# EAGLE design ESP12Proto-V1.0 (EAGLE 7.4.0)
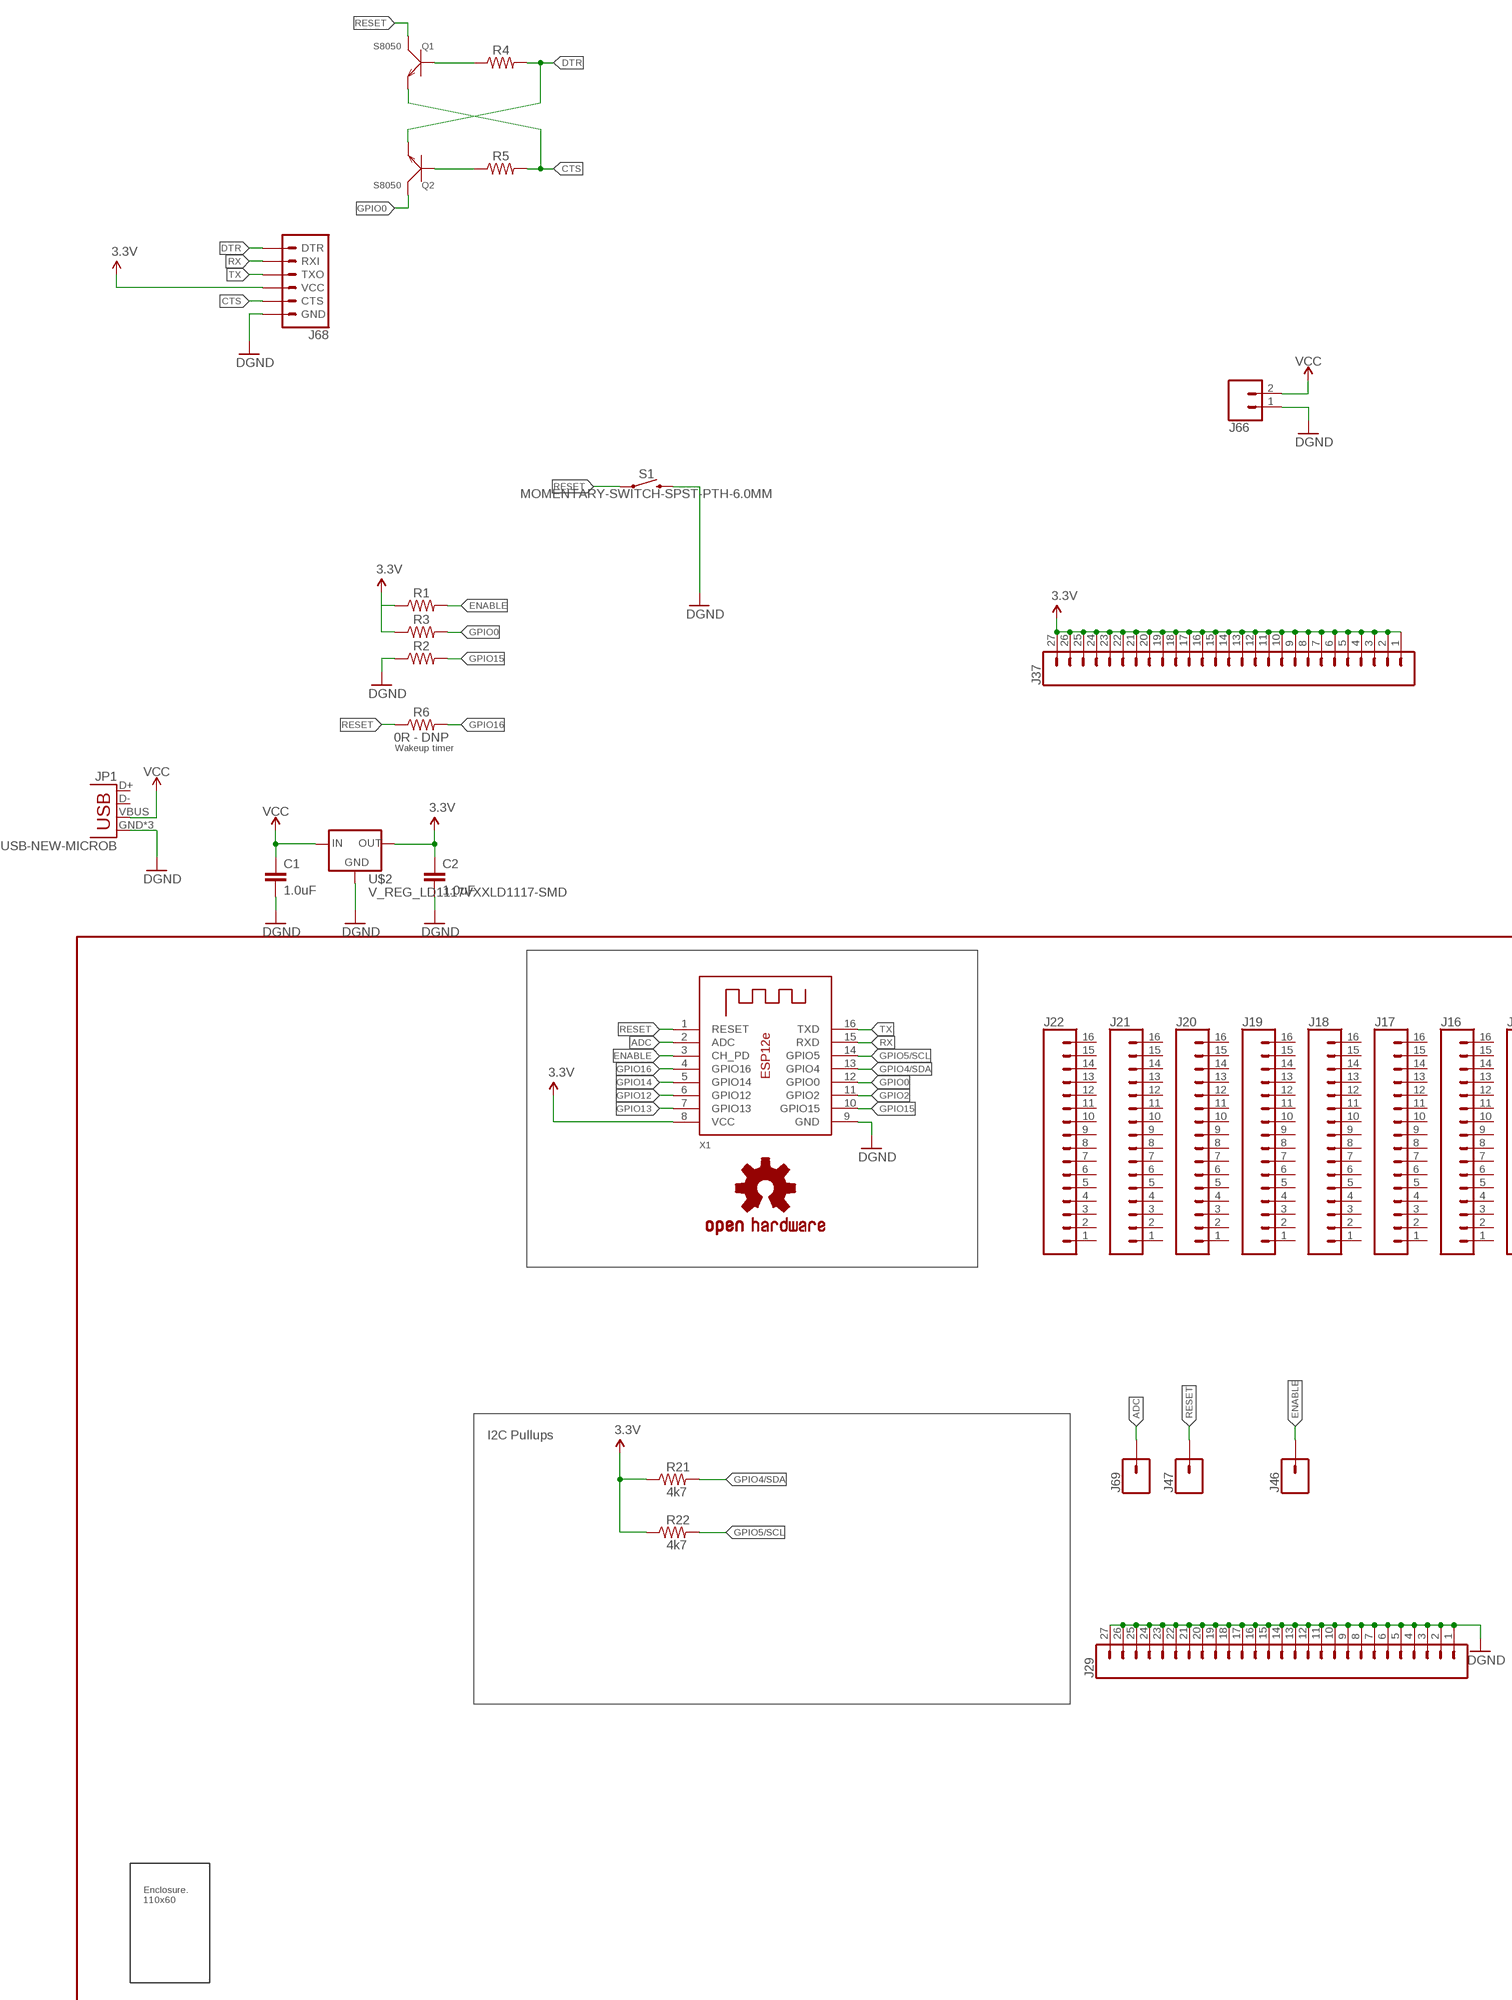
[diagram p0: schematic, sheet 1, part 1 of 2]
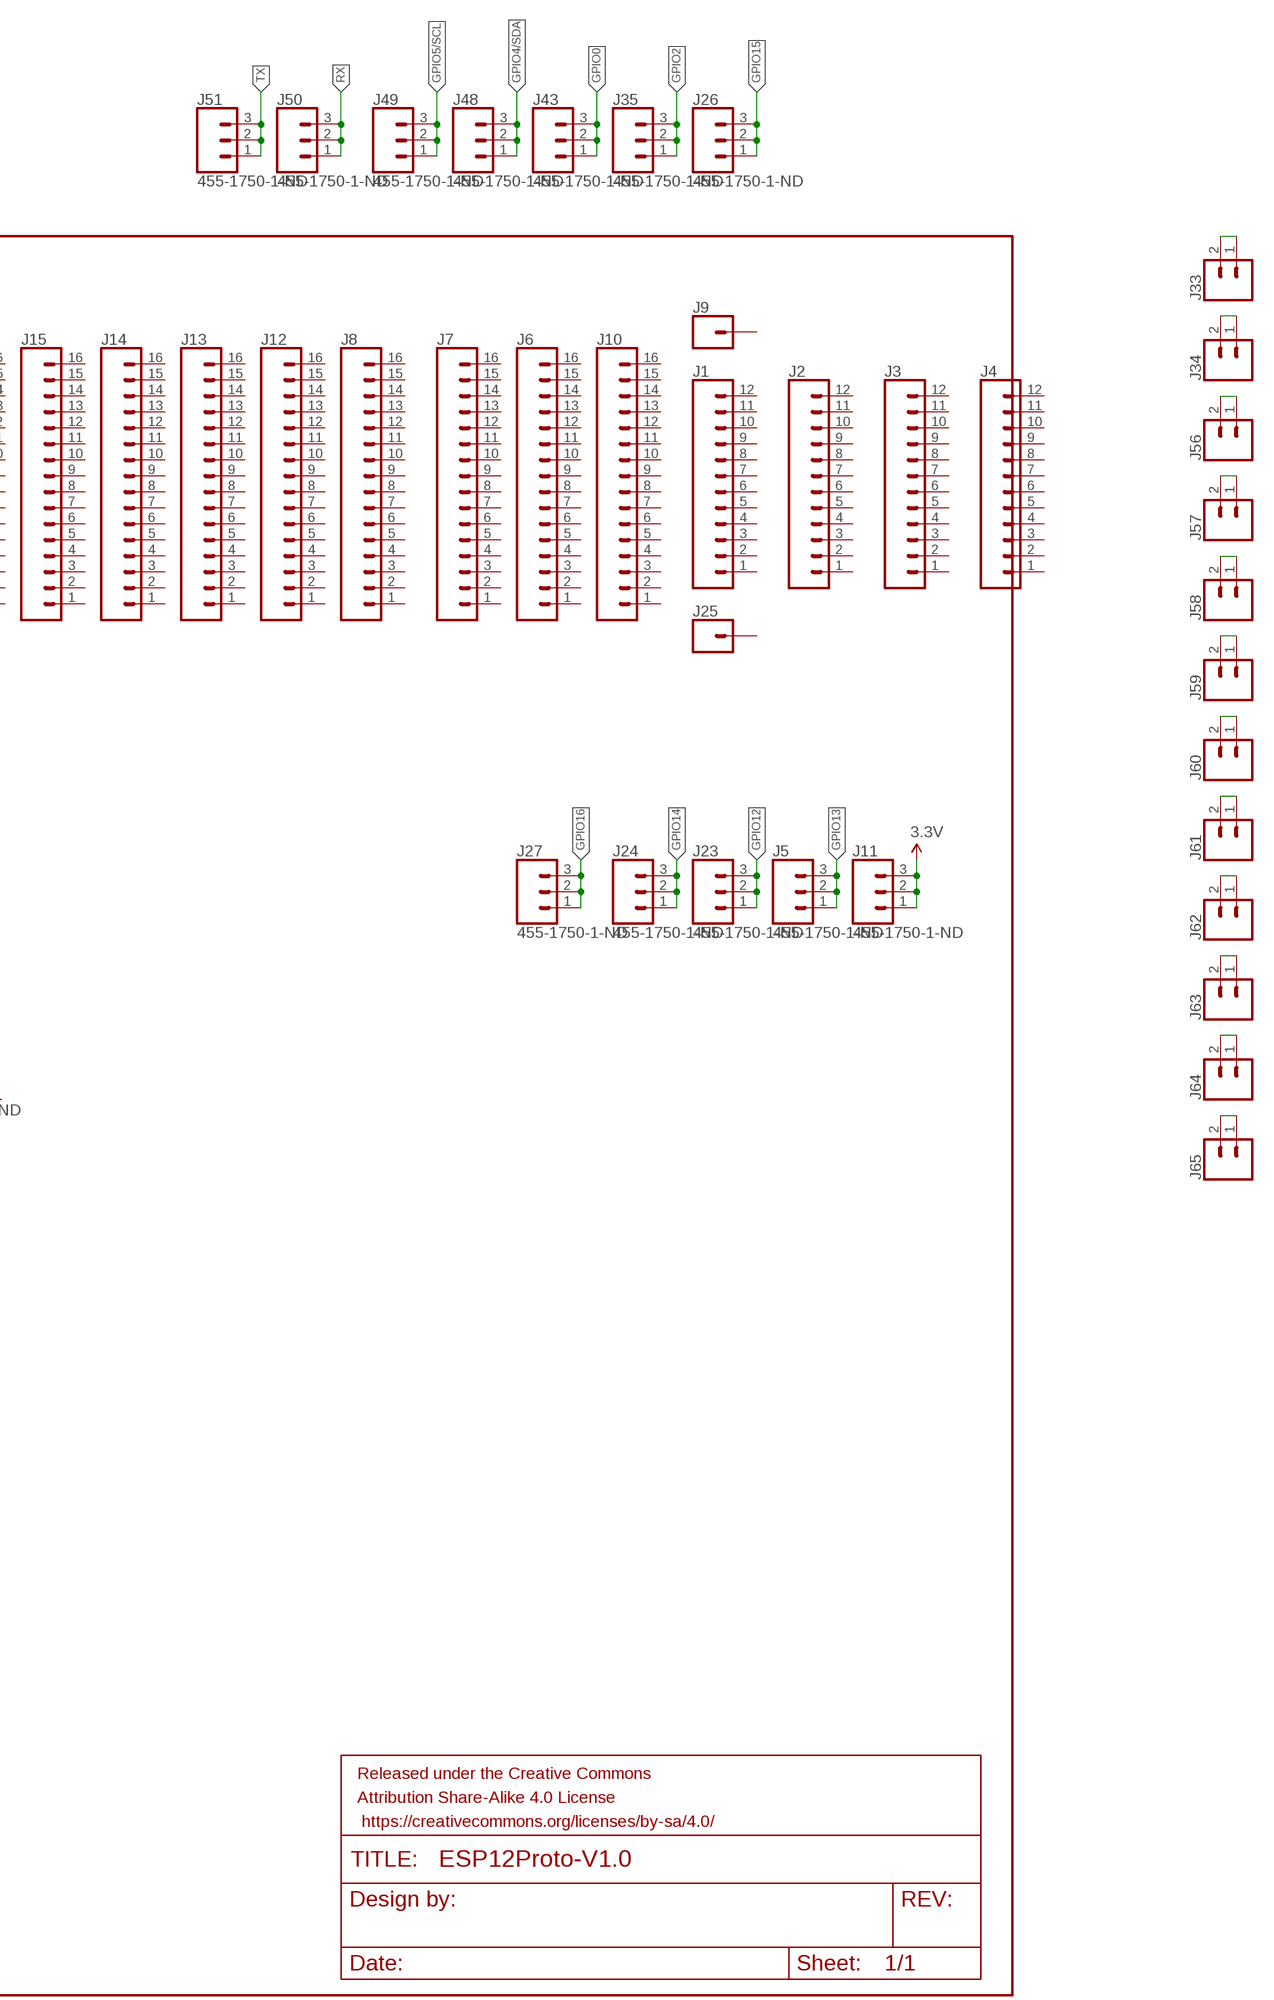
[diagram p1: schematic, sheet 1, part 2 of 2]

## Parts
C1  1.0uF  1.0UF-0805-25V-10%  [0805]
C2  1.0uF  1.0UF-0805-25V-10%  [0805]
FRAME2  FRAME-LEDGER  [CREATIVE_COMMONS]
J1  CONN_12NO_SILK  [1X12_NO_SILK]
J2  CONN_12NO_SILK  [1X12_NO_SILK]
J3  CONN_12NO_SILK  [1X12_NO_SILK]
J4  CONN_12NO_SILK  [1X12_NO_SILK]
J5  455-1750-1-ND  CONN_03  [1X03]
J6  CONN_161X16_NO_SILK  [1X16_NO_SILK]
J7  CONN_161X16_NO_SILK  [1X16_NO_SILK]
J8  CONN_161X16_NO_SILK  [1X16_NO_SILK]
J9  CONN_01PTH_NO_SILK_YES_STOP  [1X01_NO_SILK]
J10  CONN_161X16_NO_SILK  [1X16_NO_SILK]
J11  455-1750-1-ND  CONN_03  [1X03]
J12  CONN_161X16_NO_SILK  [1X16_NO_SILK]
J13  CONN_161X16_NO_SILK  [1X16_NO_SILK]
J14  CONN_161X16_NO_SILK  [1X16_NO_SILK]
J15  CONN_161X16_NO_SILK  [1X16_NO_SILK]
J16  CONN_161X16_NO_SILK  [1X16_NO_SILK]
J17  CONN_161X16_NO_SILK  [1X16_NO_SILK]
J18  CONN_161X16_NO_SILK  [1X16_NO_SILK]
J19  CONN_161X16_NO_SILK  [1X16_NO_SILK]
J20  CONN_161X16_NO_SILK  [1X16_NO_SILK]
J21  CONN_161X16_NO_SILK  [1X16_NO_SILK]
J22  CONN_161X16_NO_SILK  [1X16_NO_SILK]
J23  455-1750-1-ND  CONN_03  [1X03]
J24  455-1750-1-ND  CONN_03  [1X03]
J25  CONN_01PTH_NO_SILK_YES_STOP  [1X01_NO_SILK]
J26  455-1750-1-ND  CONN_03  [1X03]
J27  455-1750-1-ND  CONN_03  [1X03]
J29  CONN_27  [1X27]
J33  CONN_02  [1X02]
J34  CONN_02  [1X02]
J35  455-1750-1-ND  CONN_03  [1X03]
J37  CONN_27  [1X27]
J43  455-1750-1-ND  CONN_03  [1X03]
J46  CONN_01PTH_NO_SILK_YES_STOP  [1X01_NO_SILK]
J47  CONN_01PTH_NO_SILK_YES_STOP  [1X01_NO_SILK]
J48  455-1750-1-ND  CONN_03  [1X03]
J49  455-1750-1-ND  CONN_03  [1X03]
J50  455-1750-1-ND  CONN_03  [1X03]
J51  455-1750-1-ND  CONN_03  [1X03]
J56  CONN_02  [1X02]
J57  CONN_02  [1X02]
J58  CONN_02  [1X02]
J59  CONN_02  [1X02]
J60  CONN_02  [1X02]
J61  CONN_02  [1X02]
J62  CONN_02  [1X02]
J63  CONN_02  [1X02]
J64  CONN_02  [1X02]
J65  CONN_02  [1X02]
J66  CONN_02-JST-2MM-SMT  [JST-2-SMD]
J68  6_PIN_SERIAL_TARGETSILK  [6_PIN_SERIAL_TARGET_SIDE_W_SILK]
J69  CONN_01PTH_NO_SILK_YES_STOP  [1X01_NO_SILK]
JP1  USB-NEW-MICROB  [USB-MICROB]
LOGO1  OSHW-LOGOM  [OSHW-LOGO-M]
Q1  S8050  SMD-TRANSISTORS-NPN-25V-500MW-S8050(SOT-23)  [SOT-23]
Q2  S8050  SMD-TRANSISTORS-NPN-25V-500MW-S8050(SOT-23)  [SOT-23]
R1  RESISTOR0805  [0805]
R2  RESISTOR0805  [0805]
R3  RESISTOR0805  [0805]
R4  RESISTOR0805  [0805]
R5  RESISTOR0805  [0805]
R6  0R - DNP  RESISTOR0805  [0805]
R21  4k7  RESISTOR0805  [0805]
R22  4k7  RESISTOR0805  [0805]
S1  MOMENTARY-SWITCH-SPST-PTH-6.0MM  [TACTILE_SWITCH_PTH_6.0MM]
U$1  CAMDENBOSS-ENCLOSURE-110X60BOTH-EXTENDED-WIDE  [CAMDENBOSS_ENCLOSURE_110X60_WIDE_EXTENDED]
U$2  V_REG_LD1117VXXLD1117-SMD  [SOT223]
X1  ESP-12E  [ESP-12E]

## Nets
3.3V: C2.1 J11.1 J11.2 J11.3 J37.1 J37.2 J37.3 J37.4 J37.5 J37.6 J37.7 J37.8 J37.9 J37.10 J37.11 J37.12 J37.13 J37.14 J37.15 J37.16 J37.17 J37.18 J37.19 J37.20 J37.21 J37.22 J37.23 J37.24 J37.25 J37.26 J37.27 J68.P$4(VCC) R1.1 R3.1 R21.1 R22.1 U$2.2(OUT) X1.8(VCC)
ADC: J69.1 X1.2(ADC)
CTS: J68.P$5(CTS) Q1.2(E) R5.2
DTR: J68.P$1(DTR) Q2.2(E) R4.2
ENABLE: J46.1 R1.2 X1.3(CH_PD)
GND: C1.2 C2.2 J29.1 J29.2 J29.3 J29.4 J29.5 J29.6 J29.7 J29.8 J29.9 J29.10 J29.11 J29.12 J29.13 J29.14 J29.15 J29.16 J29.17 J29.18 J29.19 J29.20 J29.21 J29.22 J29.23 J29.24 J29.25 J29.26 J29.27 J66.1 J68.P$6(GND) JP1.GND JP1.MT1(GND) JP1.MT2(GND) R2.1 S1.3 U$2.1(GND) X1.9(GND) ; supply symbol labelled DGND
GPIO0: J43.1 J43.2 J43.3 Q2.3(C) R3.2 X1.12(GPIO0)
GPIO2: J35.1 J35.2 J35.3 X1.11(GPIO2)
GPIO4/SDA: J48.1 J48.2 J48.3 R21.2 X1.13(GPIO4)
GPIO5/SCL: J49.1 J49.2 J49.3 R22.2 X1.14(GPIO5)
GPIO12: J23.1 J23.2 J23.3 X1.6(GPIO12)
GPIO13: J5.1 J5.2 J5.3 X1.7(GPIO13)
GPIO14: J24.1 J24.2 J24.3 X1.5(GPIO14)
GPIO15: J26.1 J26.2 J26.3 R2.2 X1.10(GPIO15)
GPIO16: J27.1 J27.2 J27.3 R6.2 X1.4(GPIO16)
N$21: J65.1 J65.2
N$22: J64.1 J64.2
N$23: J63.1 J63.2
N$24: J62.1 J62.2
N$25: J61.1 J61.2
N$26: J60.1 J60.2
N$27: J59.1 J59.2
N$28: J58.1 J58.2
N$29: J57.1 J57.2
N$30: J56.1 J56.2
N$31: J34.1 J34.2
N$33: J33.1 J33.2
N$35: Q2.1(B) R5.1
N$36: Q1.1(B) R4.1
RESET: J47.1 Q1.3(C) R6.1 S1.1 X1.1(RESET)
RX: J50.1 J50.2 J50.3 J68.P$3(RXI) X1.15(RXD)
TX: J51.1 J51.2 J51.3 J68.P$2(TXO) X1.16(TXD)
VCC: C1.1 J66.2 JP1.VBUS U$2.3(IN)
Unconnected: J1.1 J1.2 J1.3 J1.4 J1.5 J1.6 J1.7 J1.8 J1.9 J1.10 J1.11 J1.12 J2.1 J2.2 J2.3 J2.4 J2.5 J2.6 J2.7 J2.8 J2.9 J2.10 J2.11 J2.12 J3.1 J3.2 J3.3 J3.4 J3.5 J3.6 J3.7 J3.8 J3.9 J3.10 J3.11 J3.12 J4.1 J4.2 J4.3 J4.4 J4.5 J4.6 J4.7 J4.8 J4.9 J4.10 J4.11 J4.12 J6.1 J6.2 J6.3 J6.4 J6.5 J6.6 J6.7 J6.8 J6.9 J6.10 J6.11 J6.12 J6.13 J6.14 J6.15 J6.16 J7.1 J7.2 J7.3 J7.4 J7.5 J7.6 J7.7 J7.8 J7.9 J7.10 J7.11 J7.12 J7.13 J7.14 J7.15 J7.16 J8.1 J8.2 J8.3 J8.4 J8.5 J8.6 J8.7 J8.8 J8.9 J8.10 J8.11 J8.12 J8.13 J8.14 J8.15 J8.16 J9.1 J10.1 J10.2 J10.3 J10.4 J10.5 J10.6 J10.7 J10.8 J10.9 J10.10 J10.11 J10.12 J10.13 J10.14 J10.15 J10.16 J12.1 J12.2 J12.3 J12.4 J12.5 J12.6 J12.7 J12.8 J12.9 J12.10 J12.11 J12.12 J12.13 J12.14 J12.15 J12.16 J13.1 J13.2 J13.3 J13.4 J13.5 J13.6 J13.7 J13.8 J13.9 J13.10 J13.11 J13.12 J13.13 J13.14 J13.15 J13.16 J14.1 J14.2 J14.3 J14.4 J14.5 J14.6 J14.7 J14.8 J14.9 J14.10 J14.11 J14.12 J14.13 J14.14 J14.15 J14.16 J15.1 J15.2 J15.3 J15.4 J15.5 J15.6 J15.7 J15.8 J15.9 J15.10 J15.11 J15.12 J15.13 J15.14 J15.15 J15.16 J16.1 J16.2 J16.3 J16.4 J16.5 J16.6 J16.7 J16.8 J16.9 J16.10 J16.11 J16.12 J16.13 J16.14 J16.15 J16.16 J17.1 J17.2 J17.3 J17.4 J17.5 J17.6 J17.7 J17.8 J17.9 J17.10 J17.11 J17.12 J17.13 J17.14 J17.15 J17.16 J18.1 J18.2 J18.3 J18.4 J18.5 J18.6 J18.7 J18.8 J18.9 J18.10 J18.11 J18.12 J18.13 J18.14 J18.15 J18.16 J19.1 J19.2 J19.3 J19.4 J19.5 J19.6 J19.7 J19.8 J19.9 J19.10 J19.11 J19.12 J19.13 J19.14 J19.15 J19.16 J20.1 J20.2 J20.3 J20.4 J20.5 J20.6 J20.7 J20.8 J20.9 J20.10 J20.11 J20.12 J20.13 J20.14 J20.15 J20.16 J21.1 J21.2 J21.3 J21.4 J21.5 J21.6 J21.7 J21.8 J21.9 J21.10 J21.11 J21.12 J21.13 J21.14 J21.15 J21.16 J22.1 J22.2 J22.3 J22.4 J22.5 J22.6 J22.7 J22.8 J22.9 J22.10 J22.11 J22.12 J22.13 J22.14 J22.15 J22.16 J25.1 JP1.D+ JP1.D-

## Notes on the sheet
- Wakeup timer
- I2C Pullups

## Library data of the parts
C1 C2 = SparkFun-Capacitors:1.0UF: 1µF ceramic capacitors A capacitor is a passive two-terminal electrical component used to store electrical energy temporarily in an electric field.; PROD_ID: CAP-08064
FRAME2 = SparkFun-Aesthetics:FRAME-LEDGER: Schematic Frame Standard 11x14 US Ledger frame
J1-J4 = SparkFun-Connectors:CONN_12: Multi connection point. Often used as Generic Header-pin footprint for 0.1 inch spaced/style header connections On any of the 0.1 inch spaced packages, you can populate with these: Break Away Headers - Straight <https://www.sparkfun.com/products/116> (PRT-00116) Break Away Male Headers - Right Angle <https://www.sparkfun.com/products/553> (PRT-00553) Female Headers <https://www.sparkfun.com/products/115> (PRT-00115) Break Away Headers - Machine Pin <https://www.sparkfun.com/products/117> (PRT-00117) Break Away Female Headers - Swiss Machine Pin <https://www.sparkfun.com/products/743> (PRT-00743) For SCREWTERMINALS and SPRING TERMINALS visit here: Screw Terimnals on SparkFun.com <https://www.sparkfun.com/search/results?term=Screw+Terminals> (5mm/3.5mm/2.54mm spacing) This device is also useful as a general connection point to wire up your design to another part of your project. Our various solder wires solder well into these plated through hole pads. Hook-Up Wire - Assortment (Stranded, 22 AWG) <https://www.sparkfun.com/products/11375> (PRT-11375) Hook-Up Wire - Assortment (Solid Core, 22 AWG) <https://www.sparkfun.com/products/11367> (PRT-11367) View the entire wire category on our website here <https://www.sparkfun.com/categories/141> Special notes: Molex polarized connector foot print use with SKU : PRT-08231 with associated crimp pins and housings. 1MM SMD Version SKU: PRT-10208 NOTES ON THE VARIANTS LOCK and LOCK_LONGPADS... This footprint was designed to help hold the alignment of a through-hole component (i.e. 6-pin header) while soldering it into place. You may notice that each hole has been shifted either up or down by 0.005 of an inch from it's more standard position (which is a perfectly straight line). This slight alteration caused the pins (the squares in the middle) to touch the edges of the holes. Because they are alternating, it causes a "brace" to hold the component in place. 0.005 has proven to be the perfect amount of "off-center" position when using our standard breakaway headers. Although looks a little odd when you look at the bare footprint, once you have a header in there, the alteration is very hard to notice. Also,if you push a header all the way into place, it is covered up entirely on the bottom side.
J5 J11 J23 J24 J26 J27 J35 J43 J48-J51 = SparkFun-Connectors:CONN_03: Multi connection point. Often used as Generic Header-pin footprint for 0.1 inch spaced/style header connections On any of the 0.1 inch spaced packages, you can populate with these: Break Away Headers - Straight <https://www.sparkfun.com/products/116> (PRT-00116) Break Away Male Headers - Right Angle <https://www.sparkfun.com/products/553> (PRT-00553) Female Headers <https://www.sparkfun.com/products/115> (PRT-00115) Break Away Headers - Machine Pin <https://www.sparkfun.com/products/117> (PRT-00117) Break Away Female Headers - Swiss Machine Pin <https://www.sparkfun.com/products/743> (PRT-00743) Stackable Header - 3 Pin (Female, 0.1") <https://www.sparkfun.com/products/13875> (PRT-13875) For SCREWTERMINALS and SPRING TERMINALS visit here: Screw Terimnals on SparkFun.com <https://www.sparkfun.com/search/results?term=Screw+Terminals> (5mm/3.5mm/2.54mm spacing) This device is also useful as a general connection point to wire up your design to another part of your project. Our various solder wires solder well into these plated through hole pads. Hook-Up Wire - Assortment (Stranded, 22 AWG) <https://www.sparkfun.com/products/11375> (PRT-11375) Hook-Up Wire - Assortment (Solid Core, 22 AWG) <https://www.sparkfun.com/products/11367> (PRT-11367) View the entire wire category on our website here <https://www.sparkfun.com/categories/141> Special notes: Molex polarized connector foot print use with SKU : PRT-08232 with associated crimp pins and housings.; PROD_ID: XXX-00000
J6-J8 J10 J12-J22 = SparkFun-Connectors:CONN_16: Multi connection point. Often used as Generic Header-pin footprint for 0.1 inch spaced/style header connections On any of the 0.1 inch spaced packages, you can populate with these: Break Away Headers - Straight <https://www.sparkfun.com/products/116> (PRT-00116) Break Away Male Headers - Right Angle <https://www.sparkfun.com/products/553> (PRT-00553) Female Headers <https://www.sparkfun.com/products/115> (PRT-00115) Break Away Headers - Machine Pin <https://www.sparkfun.com/products/117> (PRT-00117) Break Away Female Headers - Swiss Machine Pin <https://www.sparkfun.com/products/743> (PRT-00743) For SCREWTERMINALS and SPRING TERMINALS visit here: Screw Terimnals on SparkFun.com <https://www.sparkfun.com/search/results?term=Screw+Terminals> (5mm/3.5mm/2.54mm spacing) This device is also useful as a general connection point to wire up your design to another part of your project. Our various solder wires solder well into these plated through hole pads. Hook-Up Wire - Assortment (Stranded, 22 AWG) <https://www.sparkfun.com/products/11375> (PRT-11375) Hook-Up Wire - Assortment (Solid Core, 22 AWG) <https://www.sparkfun.com/products/11367> (PRT-11367) View the entire wire category on our website here <https://www.sparkfun.com/categories/141> Special notes: Molex polarized connector foot print use with SKU : PRT-08231 with associated crimp pins and housings. 1MM SMD Version SKU: PRT-10208 NOTES ON THE VARIANTS LOCK and LOCK_LONGPADS... This footprint was designed to help hold the alignment of a through-hole component (i.e. 6-pin header) while soldering it into place. You may notice that each hole has been shifted either up or down by 0.005 of an inch from it's more standard position (which is a perfectly straight line). This slight alteration caused the pins (the squares in the middle) to touch the edges of the holes. Because they are alternating, it causes a "brace" to hold the component in place. 0.005 has proven to be the perfect amount of "off-center" position when using our standard breakaway headers. Although looks a little odd when you look at the bare footprint, once you have a header in there, the alteration is very hard to notice. Also,if you push a header all the way into place, it is covered up entirely on the bottom side.
J9 J25 J46 J47 J69 = SparkFun-Connectors:CONN_01: Single connection point. Often used as Generic Header-pin footprint for 0.1 inch spaced/style header connections On any of the 0.1 inch spaced packages, you can populate with these: Break Away Headers - Straight <https://www.sparkfun.com/products/116> (PRT-00116) Break Away Male Headers - Right Angle <https://www.sparkfun.com/products/553> (PRT-00553) Female Headers <https://www.sparkfun.com/products/115> (PRT-00115) Break Away Headers - Machine Pin <https://www.sparkfun.com/products/117> (PRT-00117) Break Away Female Headers - Swiss Machine Pin <https://www.sparkfun.com/products/743> (PRT-00743) This device is also useful as a general connection point to wire up your design to another part of your project. Our various solder wires solder well into these plated through hole pads. Hook-Up Wire - Assortment (Stranded, 22 AWG) <https://www.sparkfun.com/products/11375> (PRT-11375) Hook-Up Wire - Assortment (Solid Core, 22 AWG) <https://www.sparkfun.com/products/11367> (PRT-11367) View the entire wire category on our website here <https://www.sparkfun.com/categories/141> Special notes: SMTSO-256-ET is a "flush mount" nut for a 4-40 screw. We mostly use this on specialty testbeds; it is a nice way to connect hardware to your PCB at an adjustable hieght. Also note, the SNAP packages are for using a snappable style connector. We sell a baggie of snaps and they are also used on two LilyPad designs: Snap Assortment - 30 pack (male and female) <https://www.sparkfun.com/products/11347> (DEV-11347) LilyPad Arduino SimpleSnap <https://www.sparkfun.com/products/10941> (DEV-10941) LilyPad SimpleSnap Protoboard <https://www.sparkfun.com/products/10940> (DEV-10940)
J29 J37 = SparkFun-Connectors:CONN_27: Multi connection point. Often used as Generic Header-pin footprint for 0.1 inch spaced/style header connections On any of the 0.1 inch spaced packages, you can populate with these: Break Away Headers - Straight <https://www.sparkfun.com/products/116> (PRT-00116) Break Away Male Headers - Right Angle <https://www.sparkfun.com/products/553> (PRT-00553) Female Headers <https://www.sparkfun.com/products/115> (PRT-00115) Break Away Headers - Machine Pin <https://www.sparkfun.com/products/117> (PRT-00117) Break Away Female Headers - Swiss Machine Pin <https://www.sparkfun.com/products/743> (PRT-00743) For SCREWTERMINALS and SPRING TERMINALS visit here: Screw Terimnals on SparkFun.com <https://www.sparkfun.com/search/results?term=Screw+Terminals> (5mm/3.5mm/2.54mm spacing) This device is also useful as a general connection point to wire up your design to another part of your project. Our various solder wires solder well into these plated through hole pads. Hook-Up Wire - Assortment (Stranded, 22 AWG) <https://www.sparkfun.com/products/11375> (PRT-11375) Hook-Up Wire - Assortment (Solid Core, 22 AWG) <https://www.sparkfun.com/products/11367> (PRT-11367) View the entire wire category on our website here <https://www.sparkfun.com/categories/141> Special notes: Molex polarized connector foot print use with SKU : PRT-08231 with associated crimp pins and housings. 1MM SMD Version SKU: PRT-10208 NOTES ON THE VARIANTS LOCK and LOCK_LONGPADS... This footprint was designed to help hold the alignment of a through-hole component (i.e. 6-pin header) while soldering it into place. You may notice that each hole has been shifted either up or down by 0.005 of an inch from it's more standard position (which is a perfectly straight line). This slight alteration caused the pins (the squares in the middle) to touch the edges of the holes. Because they are alternating, it causes a "brace" to hold the component in place. 0.005 has proven to be the perfect amount of "off-center" position when using our standard breakaway headers. Although looks a little odd when you look at the bare footprint, once you have a header in there, the alteration is very hard to notice. Also,if you push a header all the way into place, it is covered up entirely on the bottom side.
J33 J34 J56-J65 = SparkFun-Connectors:CONN_02: Multi connection point. Often used as Generic Header-pin footprint for 0.1 inch spaced/style header connections On any of the 0.1 inch spaced packages, you can populate with these: Break Away Headers - Straight <https://www.sparkfun.com/products/116> (PRT-00116) Break Away Male Headers - Right Angle <https://www.sparkfun.com/products/553> (PRT-00553) Female Headers <https://www.sparkfun.com/products/115> (PRT-00115) Break Away Headers - Machine Pin <https://www.sparkfun.com/products/117> (PRT-00117) Break Away Female Headers - Swiss Machine Pin <https://www.sparkfun.com/products/743> (PRT-00743) For SCREWTERMINALS and SPRING TERMINALS visit here: Screw Terimnals on SparkFun.com <https://www.sparkfun.com/search/results?term=Screw+Terminals> (5mm/3.5mm/2.54mm spacing) This device is also useful as a general connection point to wire up your design to another part of your project. Our various solder wires solder well into these plated through hole pads. Hook-Up Wire - Assortment (Stranded, 22 AWG) <https://www.sparkfun.com/products/11375> (PRT-11375) Hook-Up Wire - Assortment (Solid Core, 22 AWG) <https://www.sparkfun.com/products/11367> (PRT-11367) View the entire wire category on our website here <https://www.sparkfun.com/categories/141> Special notes: Molex polarized connector foot print use with: PRT-08233 with associated crimp pins and housings. 2.54_SCREWTERM for use with PRT-10571. 3.5mm Screw Terminal footprints for PRT-08084 5mm Screw Terminal footprints for use with PRT-08432
J66 = SparkFun-Connectors:CONN_02: Multi connection point. Often used as Generic Header-pin footprint for 0.1 inch spaced/style header connections On any of the 0.1 inch spaced packages, you can populate with these: Break Away Headers - Straight <https://www.sparkfun.com/products/116> (PRT-00116) Break Away Male Headers - Right Angle <https://www.sparkfun.com/products/553> (PRT-00553) Female Headers <https://www.sparkfun.com/products/115> (PRT-00115) Break Away Headers - Machine Pin <https://www.sparkfun.com/products/117> (PRT-00117) Break Away Female Headers - Swiss Machine Pin <https://www.sparkfun.com/products/743> (PRT-00743) For SCREWTERMINALS and SPRING TERMINALS visit here: Screw Terimnals on SparkFun.com <https://www.sparkfun.com/search/results?term=Screw+Terminals> (5mm/3.5mm/2.54mm spacing) This device is also useful as a general connection point to wire up your design to another part of your project. Our various solder wires solder well into these plated through hole pads. Hook-Up Wire - Assortment (Stranded, 22 AWG) <https://www.sparkfun.com/products/11375> (PRT-11375) Hook-Up Wire - Assortment (Solid Core, 22 AWG) <https://www.sparkfun.com/products/11367> (PRT-11367) View the entire wire category on our website here <https://www.sparkfun.com/categories/141> Special notes: Molex polarized connector foot print use with: PRT-08233 with associated crimp pins and housings. 2.54_SCREWTERM for use with PRT-10571. 3.5mm Screw Terminal footprints for PRT-08084 5mm Screw Terminal footprints for use with PRT-08432; PROD_ID: CONN-11443
J68 = SparkFun-Connectors:6_PIN_SERIAL_TARGET: 6-pin header connection for use with the "FTDI BASIC" pinout - TARGET SIDE. Also known as "Arduino Serial Program Header". It is used to mate with our FTDI Basic serial programmers using the Arduino IDE. Note, this device has "TARGET" in the name. It is intended to be used on a design that contains a target micro-controller that you wish to program. The "sister" device, named "CABLE" is inteneded to be used on a design that usually lives on the end of your USB cable and prvides the converter chip (FTDI232 or FTDI231x) to commnicate serial RX/TX. You can populate with some of these: Break Away Headers - Straight <https://www.sparkfun.com/products/116> (PRT-00116) For reference (or to suit your programming needs) check out these designs: SparkFun FTDI Basic Breakout - 5V <https://www.sparkfun.com/products/9716> (DEV-09716) SparkFun FTDI Basic Breakout - 3.3V <https://www.sparkfun.com/products/9873> (DEV-09873) SparkFun FTDI SmartBasic <https://www.sparkfun.com/products/12935> (DEV-12935) SparkFun Beefy 3 - FTDI Basic Breakout <https://www.sparkfun.com/products/13746> (DEV-13746)
JP1 = Tinamous:USB-NEW: USB Connectors USB-B-PTH is fully proven SKU : PRT-00139/CONN-08278 USB-miniB is fully proven SKU : PRT-00587 USB-A-PCB is untested. USB-A-H is throughly reviewed, but untested. Spark Fun Electronics SKU : PRT-00437 USB-B-SMT is throughly reviewed, but untested. Needs silkscreen touching up. USB-A-S has not been used/tested USB-MB-H has not been used/tested USB-MICROB has been used. CONN-09505; PROD_ID: CONN-09505
LOGO1 = SparkFun-Aesthetics:OSHW-LOGO: Open Source Hardware Logo This logo indicates the piece of hardware it is found on incorporates a OSHW license and/or adheres to the definition of open source hardware found here: http://freedomdefined.org/OSHW
Q1 Q2 = OPL_Discrete_Semiconductor:SMD-TRANSISTORS-NPN-25V-500MW-S8050(SOT-23): 305010017; MPN: S8050
R1-R6 R21 R22 = SparkFun-Resistors:RESISTOR: Generic Resistor Package
S1 = SparkFun-Switches:MOMENTARY-SWITCH-SPST: Momentary Switch (Pushbutton) - SPST Normally-open (NO) SPST momentary switches (buttons, pushbuttons). Variants PTH-12MM - 12mm square, through-hole Momentary Pushbutton Switch - 12mm Square <https://www.sparkfun.com/products/9190> (COM-09190) PTH-6.0MM, PTH-6.0MM-KIT - 6.0mm square, through-hole Mini Pushbutton Switch <https://www.sparkfun.com/products/97> (COM-00097) KIT package intended for soldering kit's - only one side of pads' copper is exposed. PTH-RIGHT-ANGLE-KIT - Right-angle, through-hole Right Angle Tactile Button <https://www.sparkfun.com/products/10791> - Used on SparkFun BigTime Watch Kit <https://www.sparkfun.com/products/11734> SMD-12MM - 12mm square, surface-mount Tactile Button - SMD (12mm) <https://www.sparkfun.com/products/12993> (COM-12993) Used on SparkFun PicoBoard <https://www.sparkfun.com/products/11888> SMD-4.5MM - 4.5mm Square Trackball Switch Used on SparkFun Blackberry Trackballer Breakout <https://www.sparkfun.com/products/13169> SMD-4.6MMX2.8MM - 4.60mm x 2.80mm, surface mount Used on SparkFun SAMD21 Mini Breakout <https://www.sparkfun.com/products/13664> SMD-5.2MM, SMD-5.2-REDUNDANT - 5.2mm square, surface-mount Mini Pushbutton Switch - SMD <https://www.sparkfun.com/products/8720> (COM-08720) Used on Arduino Pro Mini <https://www.sparkfun.com/products/11114> REDUNDANT package connects both switch circuits together SMD-6.0X3.5MM - 6.0 x 3.5mm, surface mount Momentary Reset Switch SMD <https://www.sparkfun.com/products/8229> (COM-08229) SMD-6.2MM-TALL - 6.2mm square, surface mount Tactile Button - SMD (6mm) <https://www.sparkfun.com/products/12992> Used on SparkFun Digital Sandbox <https://www.sparkfun.com/products/12651> SMD-RIGHT-ANGLE - Right-angle, surface mount Used on SparkFun Block for Intel® Edison - Arduino <https://www.sparkfun.com/products/13036>; PROD_ID: SWCH-08441; SF_SKU: COM-00097
U$1 = ThingySticks:CAMDENBOSS-ENCLOSURE-110X60
U$2 = SparkFun-IC-Power:V_REG_LD1117VXX: LD1117VXX voltage regulator. We carry the 3.3V version (COM-00526) in TO-220 package.; PROD_ID: VREG-13917
X1 = kanflo:ESP-12E: ESP12e module This is a copy of AdaFruit's device with correct pin order for GPIO4 and GPIO5.

## Board
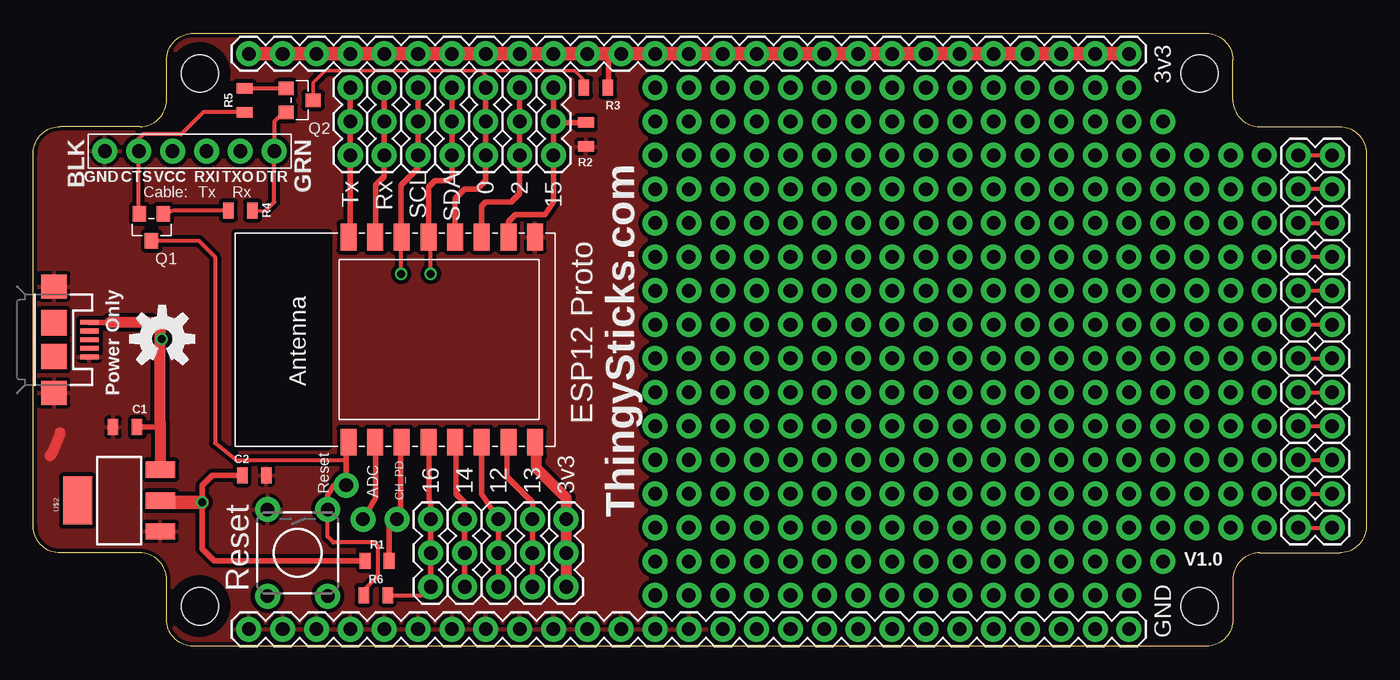
[diagram p2: board, top side]
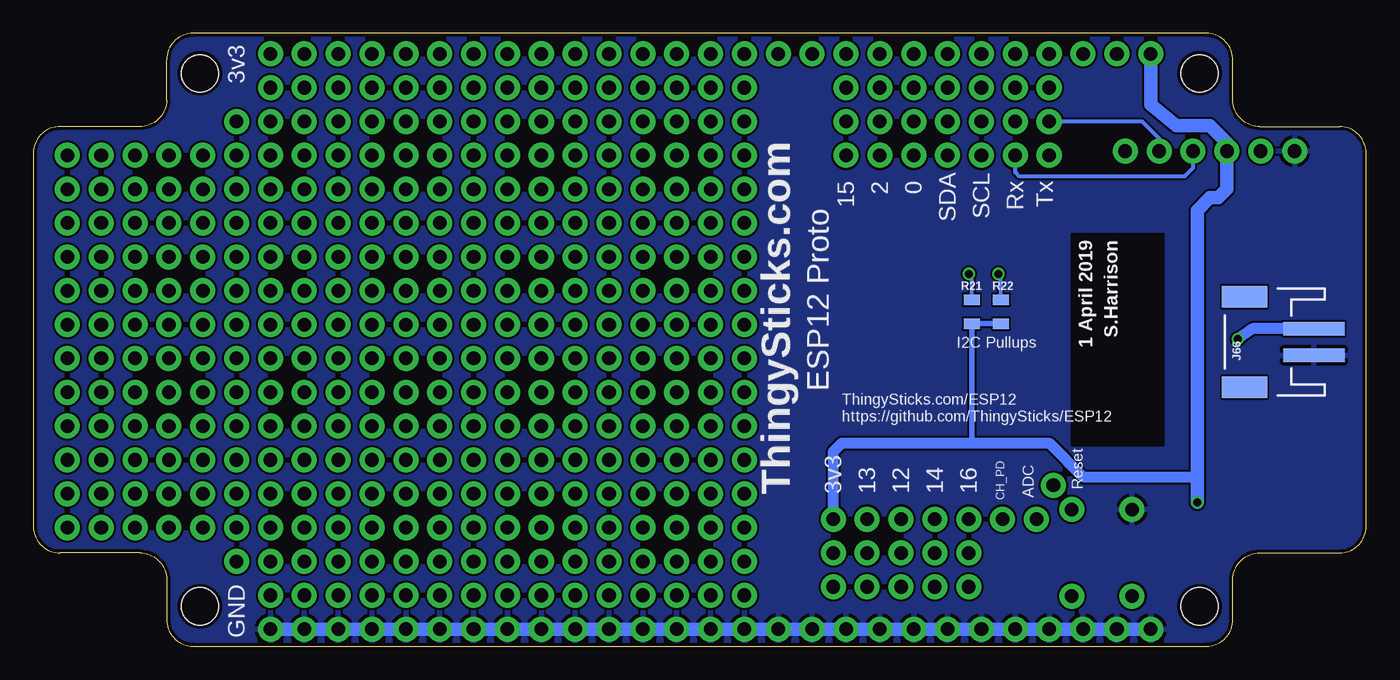
[diagram p3: board, bottom side, seen from below]

Size 100 x 46 mm. Coordinates in mm from the lower left corner, seen from the top.
Copper layers (1*16): Top 0.035mm / dielectric 1.5mm / Bottom 0.035mm
Design rules "dirt_cheap_dirty_boards.v1.1": minimum track width 6mil, minimum drill 12mil, track to track 6mil, track to pad 6mil, pad to pad 6mil, via to via 6mil, smd to smd 0mil, copper to edge 10mil, drill to drill 10mil, minimum pad ring 10mil, minimum via ring 6mil, stop-mask expansion 2mil, vias tented up to drill 25mil, thermal gap 10mil
tRestrict: area 10.5,1 to 14.5,5; area 85.5,1 to 89.5,5; area 85.5,41 to 89.5,45; area 10.5,41 to 14.5,45

### Footprints (pad centres in the part's own frame; a part is rotated, then mirrored left to right if it is on the bottom)
0805 = smd 0.8 x 1.2: 1 -0.9,0; 2 0.9,0
1X12_NO_SILK = drill 1.016 pad 1.88: 1 0,0; 2 2.54,0; 3 5.08,0; 4 7.62,0; 5 10.16,0; 6 12.7,0; 7 15.24,0; 8 17.78,0; 9 20.32,0; 10 22.86,0; 11 25.4,0; 12 27.94,0
1X03 = drill 1.016 pad 1.88: 1 0,0; 2 2.54,0; 3 5.08,0
1X16_NO_SILK = drill 1.016 pad 1.88: 1 0,0; 2 2.54,0; 3 5.08,0; 4 7.62,0; 5 10.16,0; 6 12.7,0; 7 15.24,0; 8 17.78,0; 9 20.32,0; 10 22.86,0; 11 25.4,0; 12 27.94,0; 13 30.48,0; 14 33.02,0; 15 35.56,0; 16 38.1,0
1X01_NO_SILK = drill 1.016 pad 1.88: 1 0,0
1X27 = drill 1.016 pad 1.88: 1 0,0; 2 2.54,0; 3 5.08,0; 4 7.62,0; 5 10.16,0; 6 12.7,0; 7 15.24,0; 8 17.78,0; 9 20.32,0; 10 22.86,0; 11 25.4,0; 12 27.94,0; 13 30.48,0; 14 33.02,0; 15 35.56,0; 16 38.1,0; 17 40.64,0; 18 43.18,0; 19 45.72,0; 20 48.26,0; 21 50.8,0; 22 53.34,0; 23 55.88,0; 24 58.42,0; 25 60.96,0; 26 63.5,0; 27 66.04,0
1X02 = drill 1.016 pad 1.88: 1 0,0; 2 2.54,0
JST-2-SMD = smd 1 x 4.6: 1 -1,-3.7; 2 1,-3.7 | smd 1.6 x 3.4: NC1 -3.4,1.5; NC2 3.4,1.5
6_PIN_SERIAL_TARGET_SIDE_W_SILK = drill 1.016 pad 1.88: P$1 -6.35,0; P$2 -3.81,0; P$3 -1.27,0; P$4 1.27,0; P$5 3.81,0; P$6 6.35,0
USB-MICROB = smd 0.35 x 1.4: D+ 0,2.65; D- -0.65,2.65; GND 1.3,2.65; ID 0.65,2.65; VBUS -1.3,2.65 | smd 1.8 x 1.9: MT1 -4,0; MT2 4,0 | smd 1.9 x 1.9: P$1 -1.27,0; P$2 1.27,0
SOT-23 = smd 1.016 x 1.143: 1 -0.889,-1.016; 2 0.889,-1.016; 3 0,1.016
TACTILE_SWITCH_PTH_6.0MM = drill 1.016 pad 1.88: 1 -3.251,2.261; 2 3.251,2.261; 3 -3.251,-2.261; 4 3.251,-2.261
CAMDENBOSS_ENCLOSURE_110X60_WIDE_EXTENDED = hole 2.8: 43,2.5; 43,77.5; 3,77.5; 3,2.5
SOT223 = smd 1.219 x 2.235: 1 -2.311,-3.099; 2 0,-3.099; 3 2.311,-3.099 | smd 3.6 x 2.2: 4 0,3.099
ESP-12E = smd 2 x 1.2: 1 -7.7,4.5; 2 -7.7,2.5; 3 -7.7,0.5; 4 -7.7,-1.5; 5 -7.7,-3.5; 6 -7.7,-5.5; 7 -7.7,-7.5; 8 -7.7,-9.5; 9 7.7,-9.5; 10 7.7,-7.5; 11 7.7,-5.5; 12 7.7,-3.5; 13 7.7,-1.5; 14 7.7,0.5; 15 7.7,2.5; 16 7.7,4.5

### Placement (x,y rotation side)
C1  6.89,16.46 180 top
C2  16.58,12.84 0 top
FRAME2  16.52,-14.12 0 top  (outside the outline)
J1  84.75,36.84 270 top
J2  87.29,36.84 270 top
J3  89.83,36.84 270 top
J4  92.37,36.84 270 top
J5  37.44,9.54 270 top
J6  77.13,41.92 270 top
J7  74.59,41.92 270 top
J8  79.67,41.92 270 top
J9  84.75,39.38 0 top
J10  82.21,41.92 270 top
J11  39.98,9.54 270 top
J12  72.05,41.92 270 top
J13  69.51,41.92 270 top
J14  66.97,41.92 270 top
J15  64.43,41.92 270 top
J16  61.89,41.92 270 top
J17  59.35,41.92 270 top
J18  56.81,41.92 270 top
J19  54.27,41.92 270 top
J20  51.73,41.92 270 top
J21  49.19,41.92 270 top
J22  46.65,41.92 270 top
J23  34.9,9.54 270 top
J24  32.36,9.54 270 top
J25  84.75,6.36 0 top
J26  39.03,36.84 90 top
J27  29.82,9.54 270 top
J29  16.17,1.28 0 top
J33  94.91,36.84 0 top
J34  94.91,34.3 0 top
J35  36.49,36.84 90 top
J37  16.17,44.46 0 top
J43  33.95,36.84 90 top
J46  27.28,9.54 0 top
J47  23.47,12.07 0 top
J48  31.41,36.84 90 top
J49  28.87,36.84 90 top
J50  26.33,36.84 90 top
J51  23.79,36.84 90 top
J56  94.91,31.76 0 top
J57  94.91,29.22 0 top
J58  94.91,26.68 0 top
J59  94.91,24.14 0 top
J60  94.91,21.6 0 top
J61  94.91,19.06 0 top
J62  94.91,16.52 0 top
J63  94.91,13.98 0 top
J64  94.91,11.44 0 top
J65  94.91,8.9 0 top
J66  7.62,22.84 90 bottom
J68  11.72,37.16 180 top
J69  24.74,9.54 0 top
JP1  1.56,23.01 270 top
LOGO1  9.68,23.07 0 top
Q1  8.86,31.44 180 top
Q2  19.98,40.97 270 top
R1  25.79,6.42 0 top
R2  41.47,38.4 90 top
R3  42.2,41.92 180 top
R4  15.53,32.71 0 top
R5  15.85,40.97 270 top
R6  25.69,3.82 0 top
R21  29.59,25.11 90 bottom
R22  27.39,25.11 90 bottom
S1  19.83,7.01 270 top
U$1  90,0 90 top
U$2  6.43,10.93 90 top
X1  28.15,23.01 90 top

### Tracks (layer width: path | path; a pad name or v marks a point on that pad's centre or on a via)
3.3V  (via drill 0.6)
  Top 0.406: R3.1 43.15,41.92 43.15,44.14 J37.12 | R1.1 13.57,6.42 12.67,7.31 v12.67,10.8 12.67,12.07 13.44,12.84 C2.1
  Top 0.813: X1.8 37.76,15.4 37.76,13.35 39.98,11.12 J11.1 J11.2 J11.3
  Top 1.016: J37.27 J37.26 J37.25 J37.24 J37.23 J37.22 J37.21 J37.20 J37.19 J37.18 J37.17 J37.16 J37.15 J37.14 J37.13 J37.12 J37.11 J37.10 J37.9 J37.8 J37.7 J37.6 J37.5 J37.4 J37.3 J37.2 J37.1 | v12.67,10.8 10.3,10.8 U$2.2
  Bottom 0.406: R22.1 R21.1 29.59,15.34 32.68,15.25
  Bottom 0.813: 12.67,12.71 21.25,12.71 23.79,15.25 32.68,15.25 39.34,15.25 39.98,14.62 J11.1
  Bottom 1.016: J37.1 16.17,40.65 14.26,39.06 11.72,39.06 10.45,37.79 J68.P$4 10.45,34.3 11.09,33.66 11.72,33.66 12.67,32.71 12.67,12.71 v12.67,10.8
ADC
  Top 0.406: J69.1 25.69,11.12 25.69,15.46 X1.2
CTS
  Top 0.305: Q1.2 7.85,32.65 7.91,33.03 J68.P$5 7.91,38.11 8.23,38.43 11.09,38.43 12.73,40.07 R5.2
DTR
  Top 0.305: 18.07,38.43 J68.P$1 | Q2.2 18.77,40.08 18.07,39.38 J68.P$1 | R4.2 16.75,32.66 17.44,32.71 18.07,33.35 J68.P$1
ENABLE
  Top 0.406: X1.3 27.54,15.4 27.54,10.17 J46.1 26.69,8.95 R1.2
GND
  Top 0.813: 2.01,16.02 1.38,14.43 1.24,14.3
  Bottom 1.016: J29.1 J29.2 J29.3 J29.4 J29.5 J29.6 J29.7 J29.8 J29.9 J29.10 J29.11 J29.12 J29.13 J29.14 J29.15 J29.16 J29.17 J29.18 J29.19 J29.20 J29.21 J29.22 J29.23 J29.24 J29.25 J29.26 J29.27
  pour Top (isolate 0.305, rank 3): 50.45,-0.09 9.97,-0.09 9.87,5.41 8.47,6.81 8.07,6.81 -0.03,7.01 -0.03,38.91 8.47,39.01 9.97,40.91 9.87,40.91 9.87,46.01 50.45,46.01
  pour Bottom: 6.96,0.01 -0.03,7 -0.03,40.97 5.05,46.05 93.95,46.05 99.99,40.02 99.99,6.04 93.95,0.01
GPIO0
  Top 0.254: Q2.3 20.99,42.3 21.88,43.19 33.63,43.19 | 33.63,43.19 40.61,43.19 41.25,42.55 41.25,41.97 R3.2 | J43.3 33.95,42.87 33.63,43.19
  Top 0.406: X1.12 31.65,33.59 32.36,34.3 33.31,34.3 33.95,34.93 J43.1 J43.2 J43.3 | 41.3,42.18 R3.2 41.25,41.87
GPIO2
  Top 0.406: X1.11 33.65,33.05 33.95,33.35 35.85,33.35 36.49,33.98 J35.1 J35.2 J35.3
GPIO4/SDA  (via drill 0.6)
  Top 0.305: v29.82,27.95 29.82,30.54 X1.13
  Top 0.406: X1.13 29.65,34.45 30.14,34.93 31.09,34.93 31.41,35.25 J48.1 J48.2 J48.3
  Bottom 0.305: R21.2 29.59,27.4 v29.82,27.95
GPIO5/SCL  (via drill 0.6)
  Top 0.305: v27.6,27.95 27.6,30.66 X1.14
  Top 0.406: X1.14 27.6,30.56 27.6,34.62 28.87,35.89 J49.1 J49.2 J49.3
  Bottom 0.305: R22.2 27.39,27.75 v27.6,27.95
GPIO12
  Top 0.406: X1.6 33.63,15.49 33.63,11.44 J23.1 J23.2 J23.3
GPIO13
  Top 0.406: X1.7 35.53,15.4 35.53,12.71 37.44,10.8 J5.1 J5.2 J5.3
GPIO14
  Top 0.406: X1.5 31.72,15.43 31.72,11.44 32.36,10.8 J24.1 J24.2 J24.3
GPIO15
  Top 0.406: X1.10 35.65,31.87 36.17,32.39 38.39,32.39 39.03,33.35 J26.1 | J26.1 J26.2 | J26.2 J26.3 | 39.29,36.89 J26.1 | R2.2 39.13,39.28 J26.2
GPIO16
  Top 0.305: R6.2 29.18,3.82 J27.3
  Top 0.406: X1.4 29.69,15.46 29.69,11.05 29.82,10.6 J27.1 J27.2 J27.3
N$21
  Top 0.305: J65.1 J65.2
N$22
  Top 0.305: J64.1 J64.2
N$23
  Top 0.305: J63.1 J63.2
N$24
  Top 0.305: J62.1 J62.2
N$25
  Top 0.305: J61.1 J61.2
N$26
  Top 0.305: J60.1 J60.2
N$27
  Top 0.305: J59.1 J59.2
N$28
  Top 0.305: J58.1 J58.2
N$29
  Top 0.305: J57.2 J57.1
N$30
  Top 0.305: J56.1 J56.2
N$31
  Top 0.305: J34.2 J34.1
N$33
  Top 0.305: J33.1 J33.2
N$35
  Top 0.305: Q2.1 15.86,41.86 R5.1
N$36
  Top 0.305: R4.1 10.58,32.71 Q1.1
RESET
  Top 0.305: 23.47,13.98 15.21,13.98 13.63,15.25 13.63,29.22 12.42,30.43 Q1.3 | R6.1 24.79,4.19 25.69,5.09 25.69,5.15 25.88,5.34 25.88,7.48 25.58,7.78 22.53,7.78 22.07,8.24 22.07,10.25 S1.1
  Top 0.406: S1.1 22.09,11.33 22.52,12.07 J47.1 23.47,13.98 23.47,15.33 X1.1
RX
  Top 0.406: X1.15 25.69,30.56 25.69,34.62 26.33,35.25 J50.1 J50.2 J50.3
  Bottom 0.305: J68.P$3 12.99,35.89 13.63,35.25 26.01,35.25 26.33,35.57 J50.1
TX
  Top 0.406: X1.16 23.79,30.65 J51.1 J51.2 J51.3
  Bottom 0.305: J68.P$2 15.53,38.11 16.8,39.38 J51.2
VCC  (via drill 0.6)
  Top 0.305: v9.62,23.05 9.62,23.27 9.53,22.87
  Top 0.406: 5.76,24.31 JP1.VBUS | C1.1 9.17,16.46 9.53,16.73
  Top 0.813: 5.76,24.31 8.84,24.31 9.53,23.62 9.53,22.87 9.53,16.73 U$2.3 10.2,13.21
  Bottom 0.813: J66.2 8.52,23.84 v9.62,23.05

### Text on the board
tNames: 3v3 | SCL | SDA | Tx | Rx | 0 | 2 | 15 | Cable: | Tx | Rx | Power Only | ESP12 Proto | Reset | ADC | CH_PD | 16 | 14 | 12 | 13 | 3v3 | ThingySticks.com | V1.0 | Reset | GND
bNames: 3v3 | ThingySticks.com | SCL | SDA | Tx | Rx | 0 | 2 | 15 | ESP12 Proto | S.Harrison | 1 April 2019 | I2C Pullups | ThingySticks.com/ESP12 | https://github.com/ThingySticks/ESP12 | Reset | ADC | CH_PD | 16 | 14 | 12 | 13 | 3v3 | GND